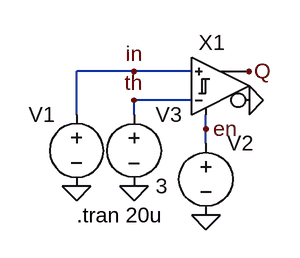
[diagram p0: schematic test-comp-en.asc]
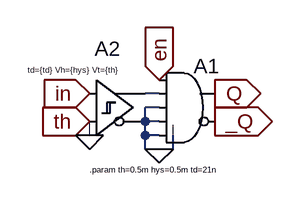
[diagram p1: sub-circuit comp_en.asc]
test-comp-en.asc, the LTspice schematic file:
Version 4
SHEET 1 880 680
WIRE 48 96 -16 96
WIRE 112 96 48 96
WIRE 112 128 48 128
WIRE -16 144 -16 96
WIRE 48 144 48 128
WIRE 128 160 128 144
WIRE 128 176 128 160
FLAG -16 224 0
FLAG 48 128 th
FLAG 48 96 in
FLAG 176 128 0
FLAG 176 96 Q
FLAG 48 224 0
FLAG 128 256 0
FLAG 128 160 en
SYMBOL voltage -16 128 M0
WINDOW 3 24 96 Invisible 2
WINDOW 123 0 0 Left 0
WINDOW 39 0 0 Left 0
SYMATTR Value PULSE(2.5 3.5 0 1u 1u 1n 2u)
SYMATTR InstName V1
SYMBOL voltage 48 128 R0
SYMATTR InstName V3
SYMATTR Value 3
SYMBOL comp_en 112 48 R0
SYMATTR InstName X1
SYMBOL voltage 128 160 R0
WINDOW 3 24 96 Invisible 2
WINDOW 123 0 0 Left 0
WINDOW 39 0 0 Left 0
SYMATTR InstName V2
SYMATTR Value PULSE(0 1 5u 1n 1n 2u 4u)
TEXT -16 256 Left 2 !.tran 20u

comp_en.asc, the sub-circuit schematic file:
Version 4
SHEET 1 1120 680
WIRE 272 112 256 112
WIRE 272 128 256 128
WIRE 256 144 256 128
WIRE 272 144 256 144
WIRE 256 160 256 144
WIRE 272 160 256 160
WIRE 256 176 256 160
WIRE 272 176 256 176
WIRE 288 176 288 160
WIRE 288 176 272 176
FLAG 192 144 th
IOPIN 192 144 In
FLAG 192 112 in
IOPIN 192 112 In
FLAG 272 96 en
IOPIN 272 96 In
FLAG 192 160 0
FLAG 336 112 Q
IOPIN 336 112 Out
FLAG 336 144 _Q
IOPIN 336 144 Out
FLAG 272 176 0
SYMBOL Digital\\diffschmitt 192 64 R0
WINDOW 3 -71 21 Left 0
WINDOW 0 6 -4 Left 2
SYMATTR Value td={td} Vh={hys} Vt={th}
SYMATTR InstName A2
SYMATTR Value2 trise=1n tfall=1n
SYMBOL Digital\\and 304 64 R0
SYMATTR InstName A1
TEXT 192 200 Left 0 !.param th=0.5m hys=0.5m td=21n

The netlist it stands for:
* test-comp-en.asc
V1 in 0 PULSE(2.5 3.5 0 1u 1u 1n 2u)
V3 th 0 3
XX1 in th en 0 Q comp_en
V2 en 0 PULSE(0 1 5u 1n 1n 2u 4u)

* block symbol definitions
.subckt comp_en in th en _Q Q
A2 in th 0 0 0 0 N001 0 SCHMITT td={td} Vh={hys} Vt={th} trise=1n tfall=1n
A1 en N001 0 0 0 _Q Q 0 AND
.param th=0.5m hys=0.5m td=21n
.ends comp_en

.tran 20u
.backanno
.end